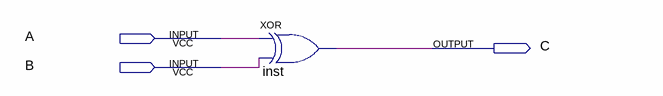
[diagram p0: schematic sheet]
// Quartus schematic introduction.bdf as structural Verilog: 1 symbols, 3 pins
module introduction (
  input  A,
  input  B,
  output C
);

  xor inst (C, A, B);
endmodule
